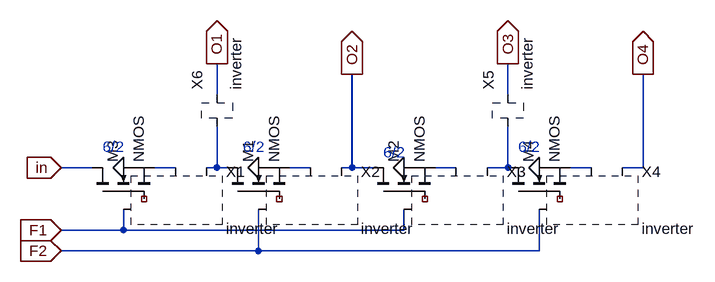
[diagram p0: schematic shift_reg.asc]
shift_reg.asc, the LTspice schematic file:
Version 4
SHEET 1 1292 836
WIRE -944 -208 -944 -256
WIRE -496 -208 -496 -256
WIRE -1136 -96 -1184 -96
WIRE -1008 -96 -1040 -96
WIRE -944 -96 -944 -160
WIRE -944 -96 -960 -96
WIRE -928 -96 -944 -96
WIRE -800 -96 -832 -96
WIRE -736 -96 -736 -240
WIRE -736 -96 -752 -96
WIRE -704 -96 -736 -96
WIRE -576 -96 -608 -96
WIRE -496 -96 -496 -160
WIRE -496 -96 -528 -96
WIRE -368 -96 -400 -96
WIRE -288 -96 -288 -240
WIRE -288 -96 -320 -96
WIRE -1088 0 -1088 -32
WIRE -1088 0 -1184 0
WIRE -656 0 -656 -32
WIRE -656 0 -1088 0
WIRE -880 32 -880 -32
WIRE -880 32 -1184 32
WIRE -448 32 -448 -32
WIRE -448 32 -880 32
FLAG -1088 -96 0
FLAG -1184 -96 in
IOPIN -1184 -96 In
FLAG -880 -96 0
FLAG -656 -96 0
FLAG -448 -96 0
FLAG -1184 0 F1
IOPIN -1184 0 In
FLAG -1184 32 F2
IOPIN -1184 32 In
FLAG -944 -256 O1
IOPIN -944 -256 Out
FLAG -736 -240 O2
IOPIN -736 -240 Out
FLAG -496 -256 O3
IOPIN -496 -256 Out
FLAG -288 -240 O4
IOPIN -288 -240 Out
SYMBOL nmos -1136 -48 R270
SYMATTR InstName M3
SYMATTR Value2 l=0.6u w=1.8u
SYMATTR Value NMOS
SYMBOL inverter -992 -96 R0
SYMATTR InstName X1
SYMBOL nmos -928 -48 R270
SYMATTR InstName M1
SYMATTR Value2 l=0.6u w=1.8u
SYMATTR Value NMOS
SYMBOL inverter -784 -96 R0
SYMATTR InstName X2
SYMBOL nmos -704 -48 R270
SYMATTR InstName M2
SYMATTR Value2 l=0.6u w=1.8u
SYMATTR Value NMOS
SYMBOL inverter -560 -96 R0
SYMATTR InstName X3
SYMBOL nmos -496 -48 R270
SYMATTR InstName M4
SYMATTR Value2 l=0.6u w=1.8u
SYMATTR Value NMOS
SYMBOL inverter -352 -96 R0
SYMATTR InstName X4
SYMBOL inverter -496 -176 R270
SYMATTR InstName X5
SYMBOL inverter -944 -176 R270
SYMATTR InstName X6
TEXT -1120 -128 Left 0 ;6/2
TEXT -904 -128 Left 0 ;6/2
TEXT -688 -120 Left 0 ;6/2
TEXT -480 -128 Left 0 ;6/2

The netlist it stands for:
* shift_reg.asc
M3 in NC_01 N001 N001 NMOS l=0.6u w=1.8u
* X1: inverter (symbol inverter not available, pin order unknown); nets seen at it: 0, F1, N001, N002
M1 N002 NC_02 N003 N003 NMOS l=0.6u w=1.8u
* X2: inverter (symbol inverter not available, pin order unknown); nets seen at it: 0, F2, N003, O2
M2 O2 NC_03 N004 N004 NMOS l=0.6u w=1.8u
* X3: inverter (symbol inverter not available, pin order unknown); nets seen at it: 0, F1, N004, N005
M4 N005 NC_04 N006 N006 NMOS l=0.6u w=1.8u
* X4: inverter (symbol inverter not available, pin order unknown); nets seen at it: 0, F2, N006, O4
* X5: inverter (symbol inverter not available, pin order unknown); nets seen at it: N005, O3
* X6: inverter (symbol inverter not available, pin order unknown); nets seen at it: N002, O1
.model NMOS NMOS
.model PMOS PMOS
.lib standard.mos
* 6/2
* 6/2
* 6/2
* 6/2
.backanno
.end